# EAGLE design template (EAGLE 8.4.2)
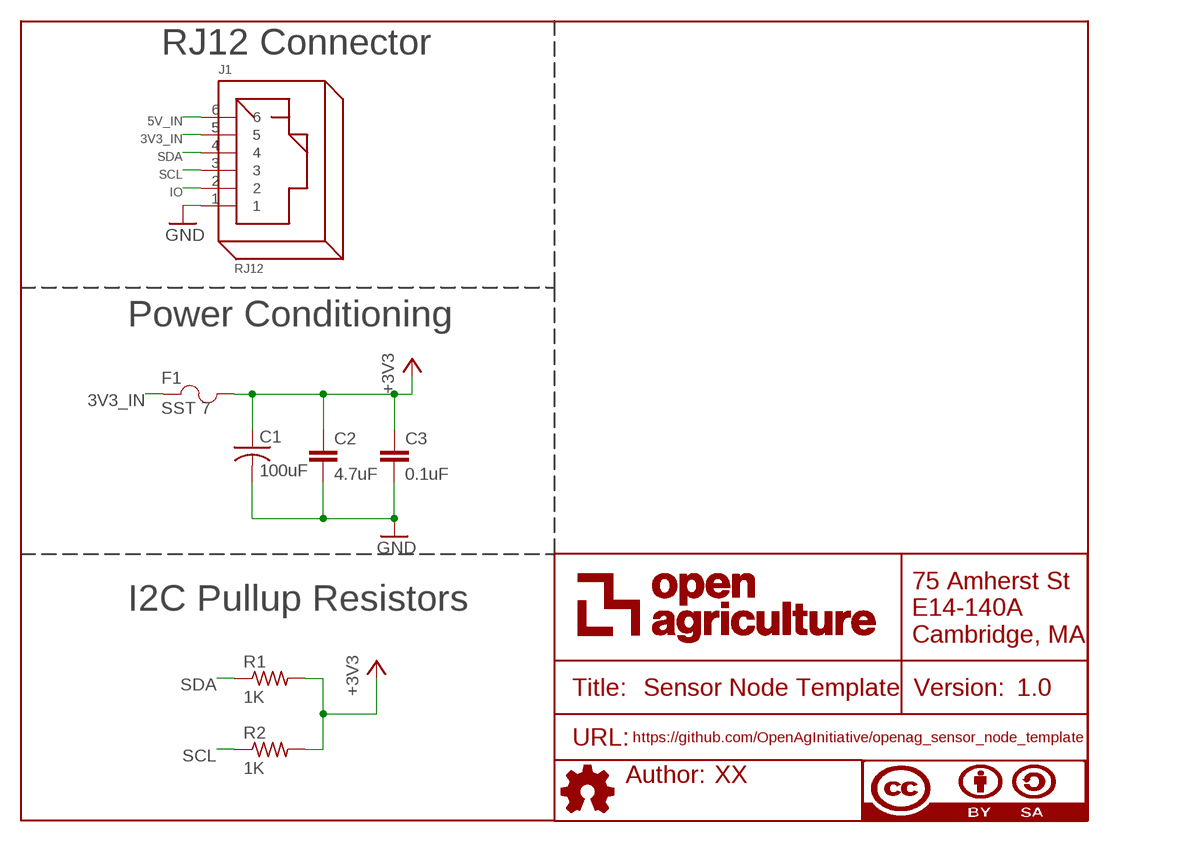
[diagram p0: schematic, sheet 1]

## Parts
C1  100uF  100UF-EEE-1HA101UP  [EEE-1HA101UP]
C2  4.7uF  4.7UF-CL21A475KBQNNNE  [C0805]
C3  0.1uF  0.1UF-C0603C104K5RACTU  [C0603]
F1  SST 7  SST_7  [SS]
FRAME1  DOCFIELD  [DOCFIELD]
J1  RJ12  A-2004-1-4-LP-N-R  [RJ12]
R1  1K  1K-ERJ-PB3D1001V  [RC0603N]
R2  1K  1K-ERJ-PB3D1001V  [RC0603N]

## Nets
3V3_IN: F1.1 J1.5
5V_IN: J1.6
+3V3: C1.+(1(+)) C2.1 C3.1 F1.2 R1.2 R2.2
GND: C1.-(2(-)) C2.2 C3.2 J1.1
IO: J1.2
SCL: J1.3 R2.1
SDA: J1.4 R1.1

## Notes on the sheet
- RJ12 Connector
- Power Conditioning
- I2C Pullup Resistors

## Library data of the parts
C1 = openag-capacitors:100UF-EEE-1HA101UP: Panasonic - EEE-1HA101UP - ELECTROLYTIC CAP ALUM 100UF 20% 50V SMD Description: 100µF 50V Aluminum Electrolytic Capacitors Radial, Can - SMD 2000 Hrs @ 85°C Technical Specifications: Capacitance: 100uF Tolerance: ±20% Rated Voltage: 50V Polarization: Polar Operating Temperature: -40°C ~ 85°C Datasheet(s): S Series, Type V <https://industrial.panasonic.com/cdbs/www-data/pdf/RDE0000/ABA0000C1145.pdf> Vendor(s): Digikey: PCE3917CT-ND <https://www.digikey.com/product-detail/en/panasonic-electronic-components/EEE-1HA101UP/PCE3917CT-ND/766293>; POPULATE: YES; VERIFIED: NO
C2 = openag-capacitors:4.7UF-CL21A475KBQNNNE: Samsung - CL21A475KBQNNNE - CAP CER 4.7UF 50V X5R 0805 Description: 4.7µF ±10% 50V Ceramic Capacitor X5R 0805 (2012 Metric) Technical Specifications: Capacitance: 4.7uF Tolerance: ±10% Rated Voltage: 50V Temperature Coefficient: X5R Operating Temperature: -55°C ~ 85°C Package/Case: 0805 (2012 Metric) Datasheet(s): CL21A475KBQNNNE Characteristics <http://www.samsungsem.com/kr/front/downloadcms.do?path=/kr/support/product-search/mlcc/__icsFiles/afieldfile/2014/11/05&fileName=C_CL21A475KBQNNNE.pdf> Vendor(s): Digikey: 1276-1248-1-ND <https://www.digikey.com/product-detail/en/samsung-electro-mechanics/CL21A475KBQNNNE/1276-1248-1-ND/3889334>; POPULATE: YES; VERIFIED: NO
C3 = openag-capacitors:0.1UF-C0603C104K5RACTU: Kemet - C0603C104K5RACTU - CAP CER 0.1UF 50V X7R 0603 Description: 0.1µF ±10% 50V Ceramic Capacitor X7R 0603 (1608 Metric) Technical Specifications: Capacitance: 0.1µF Tolerance: ±10% Rated Voltage: 50V Temperature Coefficient: X7R Operating Temperature: -55°C ~ 125°C Package / Case: 0603 (1608 Metric) Datasheet(s): X7R Dielectric, 6.3-250 VDC <https://search.kemet.com/component-edge/download/datasheet/C0603C104K5RACTU.pdf> Vendor(s): Digikey: 399-5089-1-ND <https://www.digikey.com/product-detail/en/kemet/C0603C104K5RACTU/399-5089-1-ND/1465623>; POPULATE: YES; VERIFIED: NO
F1 = openag-fuses:SST_7: Bel Fuse - SST7 - FUSE BRD MNT 7A 125VAC/VDC 2SMD Description: FUSE BRD MNT 7A 125VAC/VDC 2SMD Technical Specifications: Current Rating: 7A Voltage Rating: 125V Fuse Type: Board Mount (Cartridge Style Excluded) Mounting Type: Surface Mount Operating Temperature: -55°C ~ 125°C Datasheet(s): SST Type <https://belfuse.com/resources/StewartConnector/SST.pdf> Vendor(s): Digikey: 507-1072-1-ND <https://www.digikey.com/product-detail/en/bel-fuse-inc/SST-7/507-1072-1-ND/615026>; POPULATE: YES; VERIFIED: NO
FRAME1 = openag-frames:DOCFIELD: DOCUMENT FIELD; AUTHOR: XX; DESCRIPTION: Sensor Node Template; TITLE: Sensor Node Template; URL: https://github.com/OpenAgInitiative/openag_sensor_node_template; VER: 1.0
J1 = openag-connectors:A-2004-1-4-LP-N-R: Assmann WSW Components - A-2004-1-4-LP-N-R - CONN MOD JACK 6P6C R/A UNSHLD Description: Jack Modular Connector 6p6c (RJ11, RJ12, RJ14, RJ25) 90° Angle (Right) Unshielded Technical Specifications: Connector Type: Jack Number of Positions/Contacts: 6p6c (RJ11, RJ12, RJ14, RJ25) Number of Ports: 1 Number of Rows: 1 Mounting Type: Through Hole Orientation: 90° Angle (Right) Termination: Solder Shielding: Unshielded Features: Board Lock LED Color: Does Not Contain LED Tab Direction: Down Contact Material: Phosphor Bronze Contact Finish: Gold Contact Finish Thickness: 6µin (0.152µm) Housing Material: Polybutylene Terephthalate (PBT), Glass Filled Operating Temperature: -40°C ~ 85°C Datasheet(s): A-2004-1-4-LP-N Drawing <http://www.assmann-wsw.com/fileadmin/datasheets/ASS_7320_CO.pdf> Vendor(s): Digikey: AE10383-ND <https://www.digikey.com/product-detail/en/assmann-wsw-components/A-2004-1-4-LP-N-R/AE10383-ND/2183634>; POPULATE: YES; VERIFIED: NO
R1 R2 = openag-resistors:1K-ERJ-PB3D1001V: Panasonic - P20283CT-ND - RES SMD 1K OHM 0.5% 1/5W 0603 Description: 1 kOhms ±0.5% 0.2W, 1/5W Chip Resistor 0603 (1608 Metric) Automotive AEC-Q200, Pulse Withstanding Thick Film Technical Specifications: Resistance: 1 kOhms Tolerance: ±0.5% Power: 0.2W, 1/5W Operating Temperature: -55°C ~ 155°C Package / Case: 0603 (1608 Metric) Datasheet(s): ERJ-PB3, PB6 Series, High Precision Datasheet <https://industrial.panasonic.com/cdbs/www-data/pdf/RDM0000/AOA0000C328.pdf> Vendor(s): Digikey: P20283CT-ND <https://www.digikey.com/product-detail/en/panasonic-electronic-components/ERJ-PB3D1001V/P20283CT-ND/6214538>; POPULATE: YES; VERIFIED: NO

## Board
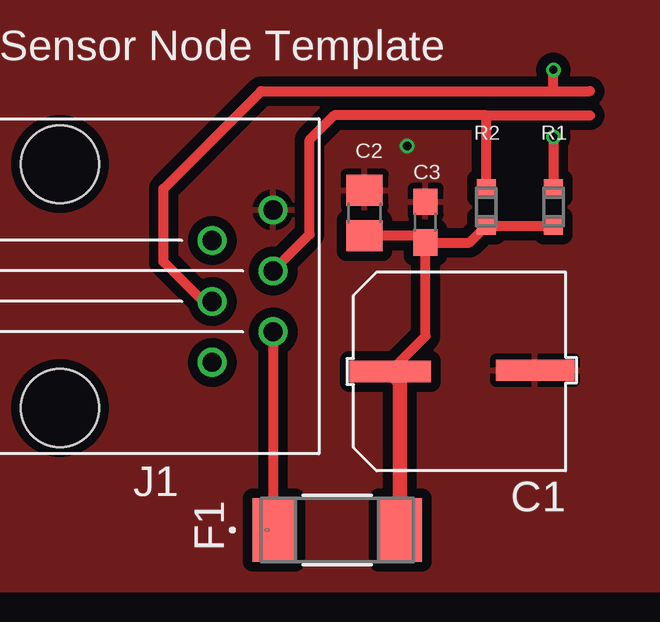
[diagram p1: board, top side]
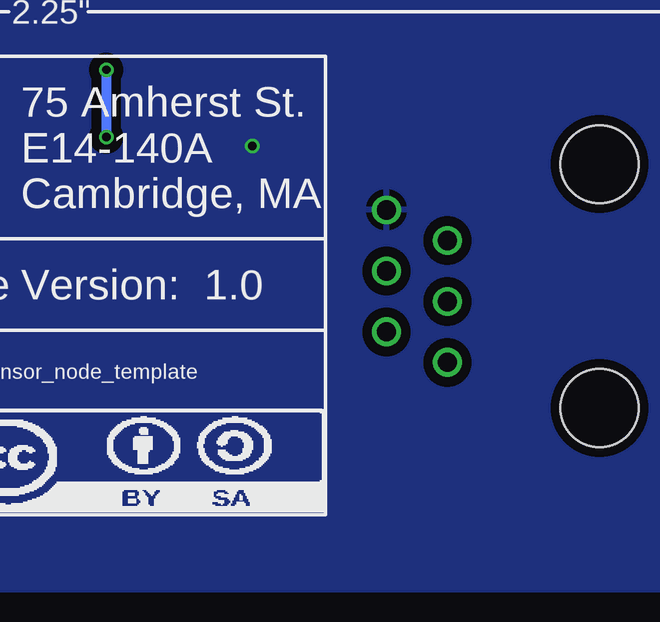
[diagram p2: board, bottom side, seen from below]

No outline drawn. Coordinates in mm, seen from the top.
Copper layers (1*16): Top 0.035559375mm / dielectric 1.6mm / Bottom 0.035559375mm
Design rules "oshpark-2layer *": minimum track width 6mil, minimum drill 10mil, track to track 6mil, track to pad 6mil, pad to pad 6mil, via to via 6mil, smd to smd 6mil, copper to edge 15mil, drill to drill 6mil, minimum pad ring 5mil, minimum via ring 5mil, stop-mask expansion 2.5mil, vias tented up to drill 20mil, thermal gap 10mil
Holes 0 mm at 3.17,3.17 3.17,22.23 60.33,22.23 60.33,3.17
tRestrict: area 1.5,20.6 to 4.8,23.9; area 1.5,1.5 to 4.8,4.8; area 58.7,20.6 to 62,23.9; area 58.7,1.5 to 62,4.8
bRestrict: area 1.5,20.6 to 4.8,23.9; area 1.5,1.5 to 4.8,4.8; area 58.7,20.6 to 62,23.9; area 58.7,1.5 to 62,4.8

### Footprints (pad centres in the part's own frame; a part is rotated, then mirrored left to right if it is on the bottom)
EEE-1HA101UP = smd 0.889 x 3.404: + 0,-3.251 | smd 0.889 x 3.251: - -0.051,2.794
C0805 = smd 1.3 x 1.5: 1 -0.95,0; 2 0.95,0
C0603 = smd 1.1 x 1: 1 -0.85,0; 2 0.85,0
SS = smd 1.803 x 2.642: 1 -2.629,0; 2 2.629,0
RJ12 = drill 0.8: 1 -8.89,-3.175; 2 -6.35,-1.905; 3 -8.89,-0.635; 4 -6.35,0.635; 5 -8.89,1.905; 6 -6.35,3.175 | hole 3.25: 0,-5.08; 0,5.08
RC0603N = smd 0.756 x 0.8: 1 -0.778,0; 2 0.778,0

### Placement (x,y rotation side)
C1  25.91,9.14 270 top
C2  21.59,15.75 90 top
C3  24.13,15.37 90 top
F1  20.45,2.54 0 top
FRAME1  58.42,3.17 0 bottom
J1  8.89,12.7 180 top
R1  29.46,16 270 top
R2  26.67,16 270 top
U$1  [OPENAG-LOGO-750-MIL]  38.1,1.02 0 top

### Tracks (layer width: path | path; a pad name or v marks a point on that pad's centre or on a via)
3V3_IN
  Top 0.406: J1.5 17.78,2.58 F1.1
+3V3
  Top 0.152: C3.1 24.19,14.58
  Top 0.406: C1.+ 24.13,10.62 C3.1 | C3.1 23.85,14.8 C2.1 | R1.2 R2.2 25.96,14.52 C3.1
  Top 0.61: F1.2 23.08,8.72 C1.+
GND  (via drill 0.35)
  other vias: 23.37,18.54
  pour Top (isolate 0.406): 0,25.4 63.5,25.4 63.5,0 0,0
  pour Bottom (isolate 0.406): 63.5,25.4 63.5,0 0,0 0,25.4
SCL
  Top 0.406: J1.3 19.3,14.86 19.3,18.8 20.32,19.81 26.67,19.81 | 26.67,19.81 30.99,19.81 | R2.1 26.67,19.81
SDA  (via drill 0.35)
  Top 0.406: J1.4 14.86,12.06 13.21,13.72 13.21,16.76 17.27,20.83 29.46,20.83 | v29.46,18.92 R1.1 | 29.46,20.83 v29.46,21.72 | 29.46,20.83 30.99,20.83
  Bottom 0.406: v29.46,21.72 v29.46,18.92

### Text on the board
tPlace: Sensor Node Template | I2C Addr: 0x??
bPlace: 2.25" | 0.125" | d=0.15" | 0.75" | 0.125"